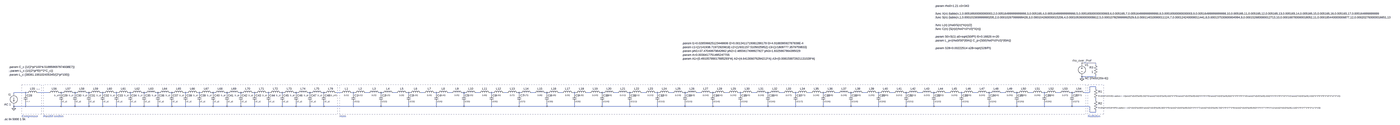
[diagram p0: schematic AC_Overall.asc, whole sheet]
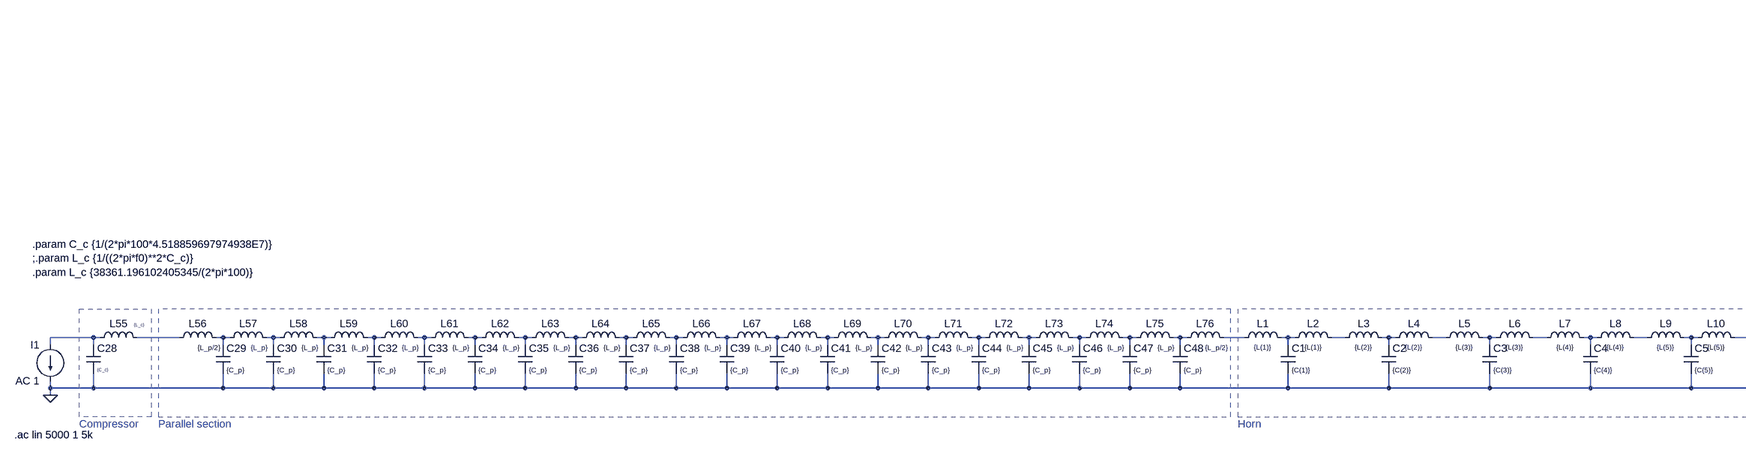
[diagram p1: schematic AC_Overall.asc, part, row 1 of 1, column 1 of 3]
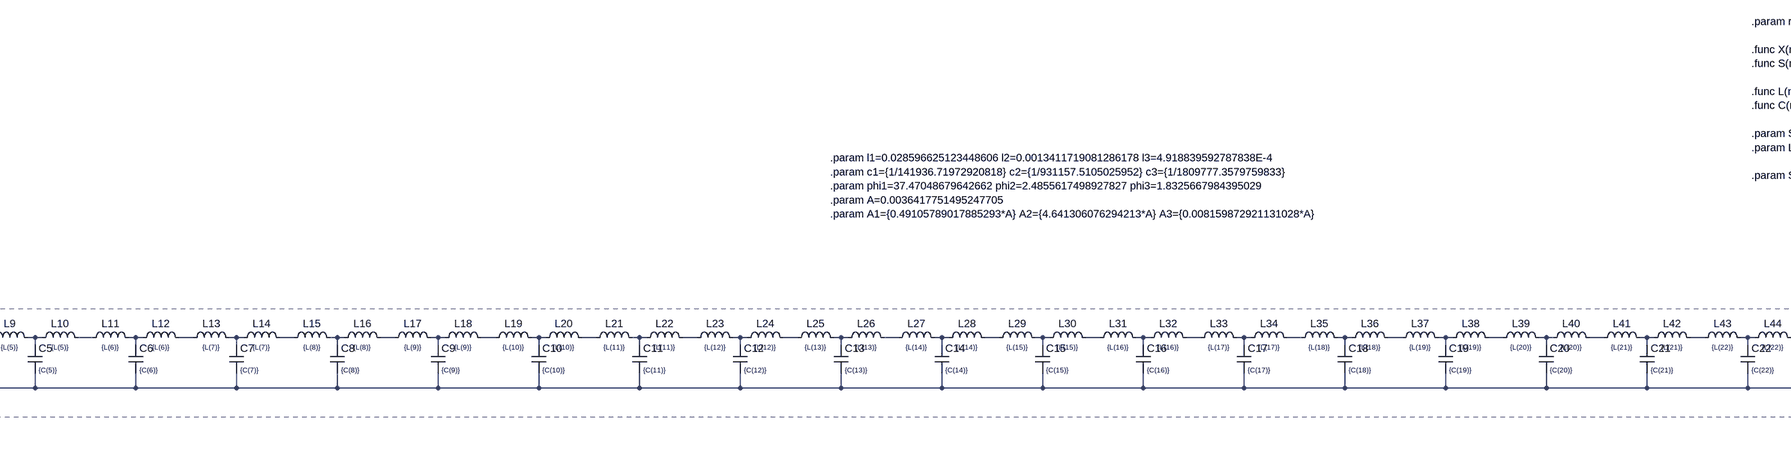
[diagram p2: schematic AC_Overall.asc, part, row 1 of 1, column 2 of 3]
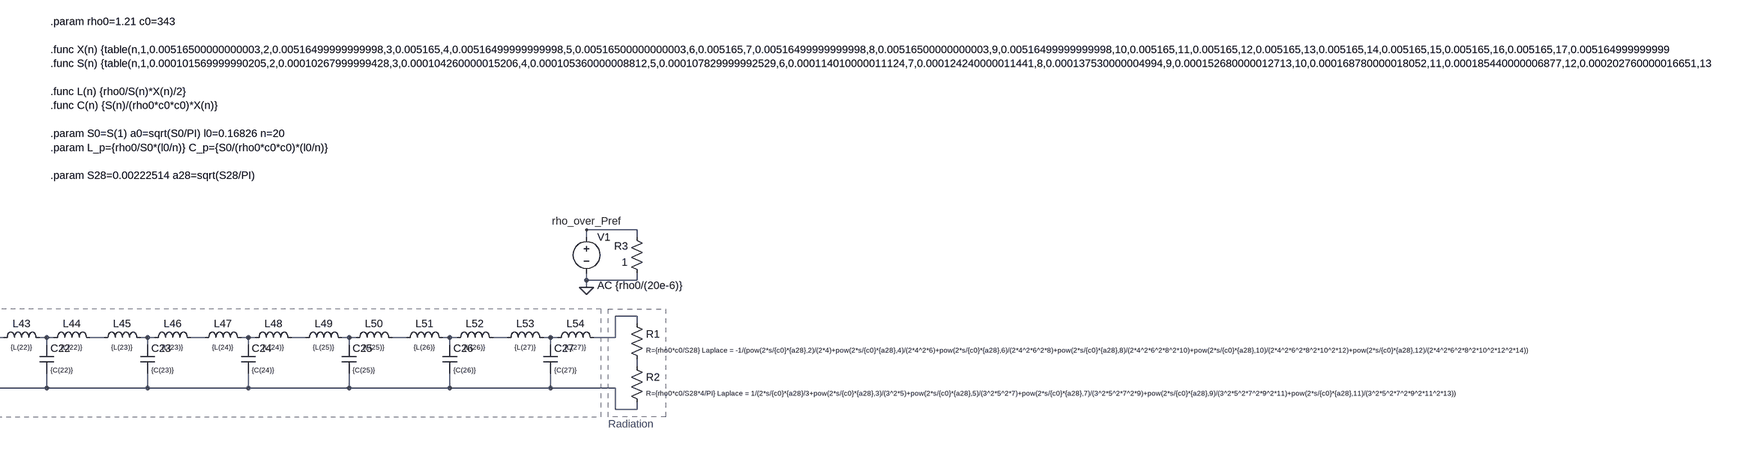
[diagram p3: schematic AC_Overall.asc, part, row 1 of 1, column 3 of 3]
AC_Overall.asc, the LTspice schematic file:
Version 4
SHEET 1 12020 680
WIRE 4432 -128 4320 -128
WIRE 4320 -112 4320 -128
WIRE 4432 -112 4432 -128
WIRE 4320 -16 4320 -32
WIRE 4432 -16 4432 -32
WIRE 4432 -16 4320 -16
WIRE 4320 0 4320 -16
WIRE 4432 64 4384 64
WIRE 4432 80 4432 64
WIRE -4240 112 -4336 112
WIRE -4224 112 -4240 112
WIRE -4048 112 -4144 112
WIRE -3952 112 -3968 112
WIRE -3936 112 -3952 112
WIRE -3840 112 -3856 112
WIRE -3824 112 -3840 112
WIRE -3728 112 -3744 112
WIRE -3712 112 -3728 112
WIRE -3616 112 -3632 112
WIRE -3600 112 -3616 112
WIRE -3504 112 -3520 112
WIRE -3488 112 -3504 112
WIRE -3392 112 -3408 112
WIRE -3376 112 -3392 112
WIRE -3280 112 -3296 112
WIRE -3264 112 -3280 112
WIRE -3168 112 -3184 112
WIRE -3152 112 -3168 112
WIRE -3056 112 -3072 112
WIRE -3040 112 -3056 112
WIRE -2944 112 -2960 112
WIRE -2928 112 -2944 112
WIRE -2832 112 -2848 112
WIRE -2816 112 -2832 112
WIRE -2720 112 -2736 112
WIRE -2704 112 -2720 112
WIRE -2608 112 -2624 112
WIRE -2592 112 -2608 112
WIRE -2496 112 -2512 112
WIRE -2480 112 -2496 112
WIRE -2384 112 -2400 112
WIRE -2368 112 -2384 112
WIRE -2272 112 -2288 112
WIRE -2256 112 -2272 112
WIRE -2160 112 -2176 112
WIRE -2144 112 -2160 112
WIRE -2048 112 -2064 112
WIRE -2032 112 -2048 112
WIRE -1936 112 -1952 112
WIRE -1920 112 -1936 112
WIRE -1824 112 -1840 112
WIRE -1808 112 -1824 112
WIRE -1680 112 -1728 112
WIRE -1584 112 -1600 112
WIRE -1568 112 -1584 112
WIRE -1456 112 -1488 112
WIRE -1360 112 -1376 112
WIRE -1344 112 -1360 112
WIRE -1232 112 -1264 112
WIRE -1136 112 -1152 112
WIRE -1120 112 -1136 112
WIRE -1008 112 -1040 112
WIRE -912 112 -928 112
WIRE -896 112 -912 112
WIRE -784 112 -816 112
WIRE -688 112 -704 112
WIRE -672 112 -688 112
WIRE -560 112 -592 112
WIRE -464 112 -480 112
WIRE -448 112 -464 112
WIRE -336 112 -368 112
WIRE -240 112 -256 112
WIRE -224 112 -240 112
WIRE -112 112 -144 112
WIRE -16 112 -32 112
WIRE 0 112 -16 112
WIRE 112 112 80 112
WIRE 208 112 192 112
WIRE 224 112 208 112
WIRE 336 112 304 112
WIRE 432 112 416 112
WIRE 448 112 432 112
WIRE 560 112 528 112
WIRE 656 112 640 112
WIRE 672 112 656 112
WIRE 784 112 752 112
WIRE 880 112 864 112
WIRE 896 112 880 112
WIRE 1008 112 976 112
WIRE 1104 112 1088 112
WIRE 1120 112 1104 112
WIRE 1232 112 1200 112
WIRE 1328 112 1312 112
WIRE 1344 112 1328 112
WIRE 1456 112 1424 112
WIRE 1552 112 1536 112
WIRE 1568 112 1552 112
WIRE 1680 112 1648 112
WIRE 1776 112 1760 112
WIRE 1792 112 1776 112
WIRE 1904 112 1872 112
WIRE 2000 112 1984 112
WIRE 2016 112 2000 112
WIRE 2128 112 2096 112
WIRE 2224 112 2208 112
WIRE 2240 112 2224 112
WIRE 2352 112 2320 112
WIRE 2448 112 2432 112
WIRE 2464 112 2448 112
WIRE 2576 112 2544 112
WIRE 2672 112 2656 112
WIRE 2688 112 2672 112
WIRE 2800 112 2768 112
WIRE 2896 112 2880 112
WIRE 2912 112 2896 112
WIRE 3024 112 2992 112
WIRE 3120 112 3104 112
WIRE 3136 112 3120 112
WIRE 3248 112 3216 112
WIRE 3344 112 3328 112
WIRE 3360 112 3344 112
WIRE 3472 112 3440 112
WIRE 3568 112 3552 112
WIRE 3584 112 3568 112
WIRE 3696 112 3664 112
WIRE 3792 112 3776 112
WIRE 3808 112 3792 112
WIRE 3920 112 3888 112
WIRE 4016 112 4000 112
WIRE 4032 112 4016 112
WIRE 4144 112 4112 112
WIRE 4240 112 4224 112
WIRE 4256 112 4240 112
WIRE 4384 112 4384 64
WIRE 4384 112 4336 112
WIRE -4336 128 -4336 112
WIRE -4240 128 -4240 112
WIRE -3952 128 -3952 112
WIRE -3840 128 -3840 112
WIRE -3728 128 -3728 112
WIRE -3616 128 -3616 112
WIRE -3504 128 -3504 112
WIRE -3392 128 -3392 112
WIRE -3280 128 -3280 112
WIRE -3168 128 -3168 112
WIRE -3056 128 -3056 112
WIRE -2944 128 -2944 112
WIRE -2832 128 -2832 112
WIRE -2720 128 -2720 112
WIRE -2608 128 -2608 112
WIRE -2496 128 -2496 112
WIRE -2384 128 -2384 112
WIRE -2272 128 -2272 112
WIRE -2160 128 -2160 112
WIRE -2048 128 -2048 112
WIRE -1936 128 -1936 112
WIRE -1824 128 -1824 112
WIRE -1584 128 -1584 112
WIRE -1360 128 -1360 112
WIRE -1136 128 -1136 112
WIRE -912 128 -912 112
WIRE -688 128 -688 112
WIRE -464 128 -464 112
WIRE -240 128 -240 112
WIRE -16 128 -16 112
WIRE 208 128 208 112
WIRE 432 128 432 112
WIRE 656 128 656 112
WIRE 880 128 880 112
WIRE 1104 128 1104 112
WIRE 1328 128 1328 112
WIRE 1552 128 1552 112
WIRE 1776 128 1776 112
WIRE 2000 128 2000 112
WIRE 2224 128 2224 112
WIRE 2448 128 2448 112
WIRE 2672 128 2672 112
WIRE 2896 128 2896 112
WIRE 3120 128 3120 112
WIRE 3344 128 3344 112
WIRE 3568 128 3568 112
WIRE 3792 128 3792 112
WIRE 4016 128 4016 112
WIRE 4240 128 4240 112
WIRE 4432 176 4432 160
WIRE -4336 224 -4336 208
WIRE -4240 224 -4240 192
WIRE -4240 224 -4336 224
WIRE -3952 224 -3952 192
WIRE -3952 224 -4240 224
WIRE -3840 224 -3840 192
WIRE -3840 224 -3952 224
WIRE -3728 224 -3728 192
WIRE -3728 224 -3840 224
WIRE -3616 224 -3616 192
WIRE -3616 224 -3728 224
WIRE -3504 224 -3504 192
WIRE -3504 224 -3616 224
WIRE -3392 224 -3392 192
WIRE -3392 224 -3504 224
WIRE -3280 224 -3280 192
WIRE -3280 224 -3392 224
WIRE -3168 224 -3168 192
WIRE -3168 224 -3280 224
WIRE -3056 224 -3056 192
WIRE -3056 224 -3168 224
WIRE -2944 224 -2944 192
WIRE -2944 224 -3056 224
WIRE -2832 224 -2832 192
WIRE -2832 224 -2944 224
WIRE -2720 224 -2720 192
WIRE -2720 224 -2832 224
WIRE -2608 224 -2608 192
WIRE -2608 224 -2720 224
WIRE -2496 224 -2496 192
WIRE -2496 224 -2608 224
WIRE -2384 224 -2384 192
WIRE -2384 224 -2496 224
WIRE -2272 224 -2272 192
WIRE -2272 224 -2384 224
WIRE -2160 224 -2160 192
WIRE -2160 224 -2272 224
WIRE -2048 224 -2048 192
WIRE -2048 224 -2160 224
WIRE -1936 224 -1936 192
WIRE -1936 224 -2048 224
WIRE -1824 224 -1824 192
WIRE -1824 224 -1936 224
WIRE -1584 224 -1584 192
WIRE -1584 224 -1824 224
WIRE -1360 224 -1360 192
WIRE -1360 224 -1584 224
WIRE -1136 224 -1136 192
WIRE -1136 224 -1360 224
WIRE -912 224 -912 192
WIRE -912 224 -1136 224
WIRE -688 224 -688 192
WIRE -688 224 -912 224
WIRE -464 224 -464 192
WIRE -464 224 -688 224
WIRE -240 224 -240 192
WIRE -240 224 -464 224
WIRE -16 224 -16 192
WIRE -16 224 -240 224
WIRE 208 224 208 192
WIRE 208 224 -16 224
WIRE 432 224 432 192
WIRE 432 224 208 224
WIRE 656 224 656 192
WIRE 656 224 432 224
WIRE 880 224 880 192
WIRE 880 224 656 224
WIRE 1104 224 1104 192
WIRE 1104 224 880 224
WIRE 1328 224 1328 192
WIRE 1328 224 1104 224
WIRE 1552 224 1552 192
WIRE 1552 224 1328 224
WIRE 1776 224 1776 192
WIRE 1776 224 1552 224
WIRE 2000 224 2000 192
WIRE 2000 224 1776 224
WIRE 2224 224 2224 192
WIRE 2224 224 2000 224
WIRE 2448 224 2448 192
WIRE 2448 224 2224 224
WIRE 2672 224 2672 192
WIRE 2672 224 2448 224
WIRE 2896 224 2896 192
WIRE 2896 224 2672 224
WIRE 3120 224 3120 192
WIRE 3120 224 2896 224
WIRE 3344 224 3344 192
WIRE 3344 224 3120 224
WIRE 3568 224 3568 192
WIRE 3568 224 3344 224
WIRE 3792 224 3792 192
WIRE 3792 224 3568 224
WIRE 4016 224 4016 192
WIRE 4016 224 3792 224
WIRE 4240 224 4240 192
WIRE 4240 224 4016 224
WIRE 4384 224 4240 224
WIRE -4336 240 -4336 224
WIRE 4384 272 4384 224
WIRE 4432 272 4432 256
WIRE 4432 272 4384 272
FLAG -4336 240 0
FLAG 4320 0 0
FLAG 4320 -128 rho_over_Pref
SYMBOL ind -1696 128 R270
WINDOW 0 32 56 VTop 2
WINDOW 3 5 56 VBottom 1
SYMATTR InstName L1
SYMATTR Value {L(1)}
SYMBOL ind -1584 128 R270
WINDOW 0 32 56 VTop 2
WINDOW 3 5 56 VBottom 1
SYMATTR InstName L2
SYMATTR Value {L(1)}
SYMBOL cap -1600 128 R0
WINDOW 3 24 56 Left 1
SYMATTR Value {C(1)}
SYMATTR InstName C1
SYMBOL ind -1472 128 R270
WINDOW 0 32 56 VTop 2
WINDOW 3 5 56 VBottom 1
SYMATTR InstName L3
SYMATTR Value {L(2)}
SYMBOL ind -1360 128 R270
WINDOW 0 32 56 VTop 2
WINDOW 3 5 56 VBottom 1
SYMATTR InstName L4
SYMATTR Value {L(2)}
SYMBOL cap -1376 128 R0
WINDOW 3 24 56 Left 1
SYMATTR Value {C(2)}
SYMATTR InstName C2
SYMBOL ind -1248 128 R270
WINDOW 0 32 56 VTop 2
WINDOW 3 5 56 VBottom 1
SYMATTR InstName L5
SYMATTR Value {L(3)}
SYMBOL ind -1136 128 R270
WINDOW 0 32 56 VTop 2
WINDOW 3 5 56 VBottom 1
SYMATTR InstName L6
SYMATTR Value {L(3)}
SYMBOL cap -1152 128 R0
WINDOW 3 24 56 Left 1
SYMATTR Value {C(3)}
SYMATTR InstName C3
SYMBOL ind -1024 128 R270
WINDOW 0 32 56 VTop 2
WINDOW 3 5 56 VBottom 1
SYMATTR InstName L7
SYMATTR Value {L(4)}
SYMBOL ind -912 128 R270
WINDOW 0 32 56 VTop 2
WINDOW 3 5 56 VBottom 1
SYMATTR InstName L8
SYMATTR Value {L(4)}
SYMBOL cap -928 128 R0
WINDOW 3 24 56 Left 1
SYMATTR Value {C(4)}
SYMATTR InstName C4
SYMBOL ind -800 128 R270
WINDOW 0 32 56 VTop 2
WINDOW 3 5 56 VBottom 1
SYMATTR InstName L9
SYMATTR Value {L(5)}
SYMBOL ind -688 128 R270
WINDOW 0 32 56 VTop 2
WINDOW 3 5 56 VBottom 1
SYMATTR InstName L10
SYMATTR Value {L(5)}
SYMBOL cap -704 128 R0
WINDOW 3 24 56 Left 1
SYMATTR Value {C(5)}
SYMATTR InstName C5
SYMBOL ind -576 128 R270
WINDOW 0 32 56 VTop 2
WINDOW 3 5 56 VBottom 1
SYMATTR InstName L11
SYMATTR Value {L(6)}
SYMBOL ind -464 128 R270
WINDOW 0 32 56 VTop 2
WINDOW 3 5 56 VBottom 1
SYMATTR InstName L12
SYMATTR Value {L(6)}
SYMBOL cap -480 128 R0
WINDOW 3 24 56 Left 1
SYMATTR Value {C(6)}
SYMATTR InstName C6
SYMBOL ind -352 128 R270
WINDOW 0 32 56 VTop 2
WINDOW 3 5 56 VBottom 1
SYMATTR InstName L13
SYMATTR Value {L(7)}
SYMBOL ind -240 128 R270
WINDOW 0 32 56 VTop 2
WINDOW 3 5 56 VBottom 1
SYMATTR InstName L14
SYMATTR Value {L(7)}
SYMBOL cap -256 128 R0
WINDOW 3 24 56 Left 1
SYMATTR Value {C(7)}
SYMATTR InstName C7
SYMBOL ind -128 128 R270
WINDOW 0 32 56 VTop 2
WINDOW 3 5 56 VBottom 1
SYMATTR InstName L15
SYMATTR Value {L(8)}
SYMBOL ind -16 128 R270
WINDOW 0 32 56 VTop 2
WINDOW 3 5 56 VBottom 1
SYMATTR InstName L16
SYMATTR Value {L(8)}
SYMBOL cap -32 128 R0
WINDOW 3 24 56 Left 1
SYMATTR Value {C(8)}
SYMATTR InstName C8
SYMBOL ind 96 128 R270
WINDOW 0 32 56 VTop 2
WINDOW 3 5 56 VBottom 1
SYMATTR InstName L17
SYMATTR Value {L(9)}
SYMBOL ind 208 128 R270
WINDOW 0 32 56 VTop 2
WINDOW 3 5 56 VBottom 1
SYMATTR InstName L18
SYMATTR Value {L(9)}
SYMBOL cap 192 128 R0
WINDOW 3 24 56 Left 1
SYMATTR Value {C(9)}
SYMATTR InstName C9
SYMBOL ind 320 128 R270
WINDOW 0 32 56 VTop 2
WINDOW 3 5 56 VBottom 1
SYMATTR InstName L19
SYMATTR Value {L(10)}
SYMBOL ind 432 128 R270
WINDOW 0 32 56 VTop 2
WINDOW 3 5 56 VBottom 1
SYMATTR InstName L20
SYMATTR Value {L(10)}
SYMBOL cap 416 128 R0
WINDOW 3 24 56 Left 1
SYMATTR Value {C(10)}
SYMATTR InstName C10
SYMBOL ind 544 128 R270
WINDOW 0 32 56 VTop 2
WINDOW 3 5 56 VBottom 1
SYMATTR InstName L21
SYMATTR Value {L(11)}
SYMBOL ind 656 128 R270
WINDOW 0 32 56 VTop 2
WINDOW 3 5 56 VBottom 1
SYMATTR InstName L22
SYMATTR Value {L(11)}
SYMBOL cap 640 128 R0
WINDOW 3 24 56 Left 1
SYMATTR Value {C(11)}
SYMATTR InstName C11
SYMBOL ind 768 128 R270
WINDOW 0 32 56 VTop 2
WINDOW 3 5 56 VBottom 1
SYMATTR InstName L23
SYMATTR Value {L(12)}
SYMBOL ind 880 128 R270
WINDOW 0 32 56 VTop 2
WINDOW 3 5 56 VBottom 1
SYMATTR InstName L24
SYMATTR Value {L(12)}
SYMBOL cap 864 128 R0
WINDOW 3 24 56 Left 1
SYMATTR Value {C(12)}
SYMATTR InstName C12
SYMBOL ind 992 128 R270
WINDOW 0 32 56 VTop 2
WINDOW 3 5 56 VBottom 1
SYMATTR InstName L25
SYMATTR Value {L(13)}
SYMBOL ind 1104 128 R270
WINDOW 0 32 56 VTop 2
WINDOW 3 5 56 VBottom 1
SYMATTR InstName L26
SYMATTR Value {L(13)}
SYMBOL cap 1088 128 R0
WINDOW 3 24 56 Left 1
SYMATTR Value {C(13)}
SYMATTR InstName C13
SYMBOL ind 1216 128 R270
WINDOW 0 32 56 VTop 2
WINDOW 3 5 56 VBottom 1
SYMATTR InstName L27
SYMATTR Value {L(14)}
SYMBOL ind 1328 128 R270
WINDOW 0 32 56 VTop 2
WINDOW 3 5 56 VBottom 1
SYMATTR InstName L28
SYMATTR Value {L(14)}
SYMBOL cap 1312 128 R0
WINDOW 3 24 56 Left 1
SYMATTR Value {C(14)}
SYMATTR InstName C14
SYMBOL ind 1440 128 R270
WINDOW 0 32 56 VTop 2
WINDOW 3 5 56 VBottom 1
SYMATTR InstName L29
SYMATTR Value {L(15)}
SYMBOL ind 1552 128 R270
WINDOW 0 32 56 VTop 2
WINDOW 3 5 56 VBottom 1
SYMATTR InstName L30
SYMATTR Value {L(15)}
SYMBOL cap 1536 128 R0
WINDOW 3 24 56 Left 1
SYMATTR Value {C(15)}
SYMATTR InstName C15
SYMBOL ind 1664 128 R270
WINDOW 0 32 56 VTop 2
WINDOW 3 5 56 VBottom 1
SYMATTR InstName L31
SYMATTR Value {L(16)}
SYMBOL ind 1776 128 R270
WINDOW 0 32 56 VTop 2
WINDOW 3 5 56 VBottom 1
SYMATTR InstName L32
SYMATTR Value {L(16)}
SYMBOL cap 1760 128 R0
WINDOW 3 24 56 Left 1
SYMATTR Value {C(16)}
SYMATTR InstName C16
SYMBOL ind 1888 128 R270
WINDOW 0 32 56 VTop 2
WINDOW 3 5 56 VBottom 1
SYMATTR InstName L33
SYMATTR Value {L(17)}
SYMBOL ind 2000 128 R270
WINDOW 0 32 56 VTop 2
WINDOW 3 5 56 VBottom 1
SYMATTR InstName L34
SYMATTR Value {L(17)}
SYMBOL cap 1984 128 R0
WINDOW 3 24 56 Left 1
SYMATTR Value {C(17)}
SYMATTR InstName C17
SYMBOL ind 2112 128 R270
WINDOW 0 32 56 VTop 2
WINDOW 3 5 56 VBottom 1
SYMATTR InstName L35
SYMATTR Value {L(18)}
SYMBOL ind 2224 128 R270
WINDOW 0 32 56 VTop 2
WINDOW 3 5 56 VBottom 1
SYMATTR InstName L36
SYMATTR Value {L(18)}
SYMBOL cap 2208 128 R0
WINDOW 3 24 56 Left 1
SYMATTR Value {C(18)}
SYMATTR InstName C18
SYMBOL ind 2336 128 R270
WINDOW 0 32 56 VTop 2
WINDOW 3 5 56 VBottom 1
SYMATTR InstName L37
SYMATTR Value {L(19)}
SYMBOL ind 2448 128 R270
WINDOW 0 32 56 VTop 2
WINDOW 3 5 56 VBottom 1
SYMATTR InstName L38
SYMATTR Value {L(19)}
SYMBOL cap 2432 128 R0
WINDOW 3 24 56 Left 1
SYMATTR Value {C(19)}
SYMATTR InstName C19
SYMBOL ind 2560 128 R270
WINDOW 0 32 56 VTop 2
WINDOW 3 5 56 VBottom 1
SYMATTR InstName L39
SYMATTR Value {L(20)}
SYMBOL ind 2672 128 R270
WINDOW 0 32 56 VTop 2
WINDOW 3 5 56 VBottom 1
SYMATTR InstName L40
SYMATTR Value {L(20)}
SYMBOL cap 2656 128 R0
WINDOW 3 24 56 Left 1
SYMATTR Value {C(20)}
SYMATTR InstName C20
SYMBOL ind 2784 128 R270
WINDOW 0 32 56 VTop 2
WINDOW 3 5 56 VBottom 1
SYMATTR InstName L41
SYMATTR Value {L(21)}
SYMBOL ind 2896 128 R270
WINDOW 0 32 56 VTop 2
WINDOW 3 5 56 VBottom 1
SYMATTR InstName L42
SYMATTR Value {L(21)}
SYMBOL cap 2880 128 R0
WINDOW 3 24 56 Left 1
SYMATTR Value {C(21)}
SYMATTR InstName C21
SYMBOL ind 3008 128 R270
WINDOW 0 32 56 VTop 2
WINDOW 3 5 56 VBottom 1
SYMATTR InstName L43
SYMATTR Value {L(22)}
SYMBOL ind 3120 128 R270
WINDOW 0 32 56 VTop 2
WINDOW 3 5 56 VBottom 1
SYMATTR InstName L44
SYMATTR Value {L(22)}
SYMBOL cap 3104 128 R0
WINDOW 3 24 56 Left 1
SYMATTR Value {C(22)}
SYMATTR InstName C22
SYMBOL ind 3232 128 R270
WINDOW 0 32 56 VTop 2
WINDOW 3 5 56 VBottom 1
SYMATTR InstName L45
SYMATTR Value {L(23)}
SYMBOL ind 3344 128 R270
WINDOW 0 32 56 VTop 2
WINDOW 3 5 56 VBottom 1
SYMATTR InstName L46
SYMATTR Value {L(23)}
SYMBOL cap 3328 128 R0
WINDOW 3 24 56 Left 1
SYMATTR Value {C(23)}
SYMATTR InstName C23
SYMBOL ind 3456 128 R270
WINDOW 0 32 56 VTop 2
WINDOW 3 5 56 VBottom 1
SYMATTR InstName L47
SYMATTR Value {L(24)}
SYMBOL ind 3568 128 R270
WINDOW 0 32 56 VTop 2
WINDOW 3 5 56 VBottom 1
SYMATTR InstName L48
SYMATTR Value {L(24)}
SYMBOL cap 3552 128 R0
WINDOW 3 24 56 Left 1
SYMATTR Value {C(24)}
SYMATTR InstName C24
SYMBOL ind 3680 128 R270
WINDOW 0 32 56 VTop 2
WINDOW 3 5 56 VBottom 1
SYMATTR InstName L49
SYMATTR Value {L(25)}
SYMBOL ind 3792 128 R270
WINDOW 0 32 56 VTop 2
WINDOW 3 5 56 VBottom 1
SYMATTR InstName L50
SYMATTR Value {L(25)}
SYMBOL cap 3776 128 R0
WINDOW 3 24 56 Left 1
SYMATTR Value {C(25)}
SYMATTR InstName C25
SYMBOL ind 3904 128 R270
WINDOW 0 32 56 VTop 2
WINDOW 3 5 56 VBottom 1
SYMATTR InstName L51
SYMATTR Value {L(26)}
SYMBOL ind 4016 128 R270
WINDOW 0 32 56 VTop 2
WINDOW 3 5 56 VBottom 1
SYMATTR InstName L52
SYMATTR Value {L(26)}
SYMBOL cap 4000 128 R0
WINDOW 3 24 56 Left 1
SYMATTR Value {C(26)}
SYMATTR InstName C26
SYMBOL ind 4128 128 R270
WINDOW 0 32 56 VTop 2
WINDOW 3 5 56 VBottom 1
SYMATTR InstName L53
SYMATTR Value {L(27)}
SYMBOL ind 4240 128 R270
WINDOW 0 32 56 VTop 2
WINDOW 3 5 56 VBottom 1
SYMATTR InstName L54
SYMATTR Value {L(27)}
SYMBOL cap 4224 128 R0
WINDOW 3 24 56 Left 1
SYMATTR Value {C(27)}
SYMATTR InstName C27
SYMBOL res 4416 64 R0
WINDOW 3 36 76 Left 1
SYMATTR Value R={rho0*c0/S28} Laplace = -1/(pow(2*s/{c0}*{a28},2)/(2*4)+pow(2*s/{c0}*{a28},4)/(2*4^2*6)+pow(2*s/{c0}*{a28},6)/(2*4^2*6^2*8)+pow(2*s/{c0}*{a28},8)/(2*4^2*6^2*8^2*10)+pow(2*s/{c0}*{a28},10)/(2*4^2*6^2*8^2*10^2*12)+pow(2*s/{c0}*{a28},12)/(2*4^2*6^2*8^2*10^2*12^2*14))
SYMATTR InstName R1
SYMBOL res 4416 160 R0
WINDOW 3 36 76 Left 1
SYMATTR Value R={rho0*c0/S28*4/PI} Laplace = 1/(2*s/{c0}*{a28}/3+pow(2*s/{c0}*{a28},3)/(3^2*5)+pow(2*s/{c0}*{a28},5)/(3^2*5^2*7)+pow(2*s/{c0}*{a28},7)/(3^2*5^2*7^2*9)+pow(2*s/{c0}*{a28},9)/(3^2*5^2*7^2*9^2*11)+pow(2*s/{c0}*{a28},11)/(3^2*5^2*7^2*9^2*11^2*13))
SYMATTR InstName R2
SYMBOL ind -4240 128 R270
WINDOW 0 32 56 VTop 2
WINDOW 3 44 90 VRight 0
SYMATTR InstName L55
SYMATTR Value {L_c}
SYMBOL cap -4256 128 R0
WINDOW 3 24 56 Left 0
SYMATTR Value {C_c}
SYMATTR InstName C28
SYMBOL ind -4064 128 R270
WINDOW 0 32 56 VTop 2
WINDOW 3 4 81 VBottom 1
SYMATTR InstName L56
SYMATTR Value {L_p/2}
SYMBOL cap -3968 128 R0
WINDOW 3 24 56 Left 1
SYMATTR Value {C_p}
SYMATTR InstName C29
SYMBOL ind -3952 128 R270
WINDOW 0 32 56 VTop 2
WINDOW 3 4 81 VBottom 1
SYMATTR InstName L57
SYMATTR Value {L_p}
SYMBOL cap -3856 128 R0
WINDOW 3 24 56 Left 1
SYMATTR Value {C_p}
SYMATTR InstName C30
SYMBOL ind -3840 128 R270
WINDOW 0 32 56 VTop 2
WINDOW 3 4 81 VBottom 1
SYMATTR InstName L58
SYMATTR Value {L_p}
SYMBOL cap -3744 128 R0
WINDOW 3 24 56 Left 1
SYMATTR Value {C_p}
SYMATTR InstName C31
SYMBOL ind -3728 128 R270
WINDOW 0 32 56 VTop 2
WINDOW 3 4 81 VBottom 1
SYMATTR InstName L59
SYMATTR Value {L_p}
SYMBOL cap -3632 128 R0
WINDOW 3 24 56 Left 1
SYMATTR Value {C_p}
SYMATTR InstName C32
SYMBOL ind -3616 128 R270
WINDOW 0 32 56 VTop 2
WINDOW 3 4 81 VBottom 1
SYMATTR InstName L60
SYMATTR Value {L_p}
SYMBOL cap -3520 128 R0
WINDOW 3 24 56 Left 1
SYMATTR Value {C_p}
SYMATTR InstName C33
SYMBOL ind -3504 128 R270
WINDOW 0 32 56 VTop 2
WINDOW 3 4 81 VBottom 1
SYMATTR InstName L61
SYMATTR Value {L_p}
SYMBOL cap -3408 128 R0
WINDOW 3 24 56 Left 1
SYMATTR Value {C_p}
SYMATTR InstName C34
SYMBOL ind -3392 128 R270
WINDOW 0 32 56 VTop 2
WINDOW 3 4 81 VBottom 1
SYMATTR InstName L62
SYMATTR Value {L_p}
SYMBOL cap -3296 128 R0
WINDOW 3 24 56 Left 1
SYMATTR Value {C_p}
SYMATTR InstName C35
SYMBOL ind -3280 128 R270
WINDOW 0 32 56 VTop 2
WINDOW 3 4 81 VBottom 1
SYMATTR InstName L63
SYMATTR Value {L_p}
SYMBOL cap -3184 128 R0
WINDOW 3 24 56 Left 1
SYMATTR Value {C_p}
SYMATTR InstName C36
SYMBOL ind -3168 128 R270
WINDOW 0 32 56 VTop 2
WINDOW 3 4 81 VBottom 1
SYMATTR InstName L64
SYMATTR Value {L_p}
SYMBOL cap -3072 128 R0
WINDOW 3 24 56 Left 1
SYMATTR Value {C_p}
SYMATTR InstName C37
SYMBOL ind -3056 128 R270
WINDOW 0 32 56 VTop 2
WINDOW 3 4 81 VBottom 1
SYMATTR InstName L65
SYMATTR Value {L_p}
SYMBOL cap -2960 128 R0
WINDOW 3 24 56 Left 1
SYMATTR Value {C_p}
SYMATTR InstName C38
SYMBOL ind -2944 128 R270
WINDOW 0 32 56 VTop 2
WINDOW 3 4 81 VBottom 1
SYMATTR InstName L66
SYMATTR Value {L_p}
SYMBOL cap -2848 128 R0
WINDOW 3 24 56 Left 1
SYMATTR Value {C_p}
SYMATTR InstName C39
SYMBOL ind -2832 128 R270
WINDOW 0 32 56 VTop 2
WINDOW 3 4 81 VBottom 1
SYMATTR InstName L67
SYMATTR Value {L_p}
SYMBOL cap -2736 128 R0
WINDOW 3 24 56 Left 1
SYMATTR Value {C_p}
SYMATTR InstName C40
SYMBOL ind -2720 128 R270
WINDOW 0 32 56 VTop 2
WINDOW 3 4 81 VBottom 1
SYMATTR InstName L68
SYMATTR Value {L_p}
SYMBOL cap -2624 128 R0
WINDOW 3 24 56 Left 1
SYMATTR Value {C_p}
SYMATTR InstName C41
SYMBOL ind -2608 128 R270
WINDOW 0 32 56 VTop 2
WINDOW 3 4 81 VBottom 1
SYMATTR InstName L69
SYMATTR Value {L_p}
SYMBOL cap -2512 128 R0
WINDOW 3 24 56 Left 1
SYMATTR Value {C_p}
SYMATTR InstName C42
SYMBOL ind -2496 128 R270
WINDOW 0 32 56 VTop 2
WINDOW 3 4 81 VBottom 1
SYMATTR InstName L70
SYMATTR Value {L_p}
SYMBOL cap -2400 128 R0
WINDOW 3 24 56 Left 1
SYMATTR Value {C_p}
SYMATTR InstName C43
SYMBOL ind -2384 128 R270
WINDOW 0 32 56 VTop 2
WINDOW 3 4 81 VBottom 1
SYMATTR InstName L71
SYMATTR Value {L_p}
SYMBOL cap -2288 128 R0
WINDOW 3 24 56 Left 1
SYMATTR Value {C_p}
SYMATTR InstName C44
SYMBOL ind -2272 128 R270
WINDOW 0 32 56 VTop 2
WINDOW 3 4 81 VBottom 1
SYMATTR InstName L72
SYMATTR Value {L_p}
SYMBOL cap -2176 128 R0
WINDOW 3 24 56 Left 1
SYMATTR Value {C_p}
SYMATTR InstName C45
SYMBOL ind -2160 128 R270
WINDOW 0 32 56 VTop 2
WINDOW 3 4 81 VBottom 1
SYMATTR InstName L73
SYMATTR Value {L_p}
SYMBOL cap -2064 128 R0
WINDOW 3 24 56 Left 1
SYMATTR Value {C_p}
SYMATTR InstName C46
SYMBOL ind -2048 128 R270
WINDOW 0 32 56 VTop 2
WINDOW 3 4 81 VBottom 1
SYMATTR InstName L74
SYMATTR Value {L_p}
SYMBOL cap -1952 128 R0
WINDOW 3 24 56 Left 1
SYMATTR Value {C_p}
SYMATTR InstName C47
SYMBOL ind -1936 128 R270
WINDOW 0 32 56 VTop 2
WINDOW 3 4 81 VBottom 1
SYMATTR InstName L75
SYMATTR Value {L_p}
SYMBOL cap -1840 128 R0
WINDOW 3 24 56 Left 1
SYMATTR Value {C_p}
SYMATTR InstName C48
SYMBOL ind -1824 128 R270
WINDOW 0 32 56 VTop 2
WINDOW 3 4 81 VBottom 1
SYMATTR InstName L76
SYMATTR Value {L_p/2}
SYMBOL voltage 4320 -128 R0
WINDOW 123 24 124 Left 2
WINDOW 39 0 0 Left 0
SYMATTR Value2 AC {rho0/(20e-6)}
SYMATTR InstName V1
SYMATTR Value ""
SYMBOL res 4448 -16 R180
WINDOW 0 36 76 Left 2
WINDOW 3 36 40 Left 2
SYMATTR InstName R3
SYMATTR Value 1
SYMBOL current -4336 128 M0
WINDOW 123 0 0 Left 0
WINDOW 39 0 0 Left 0
SYMATTR InstName I1
SYMATTR Value AC 1
TEXT 4368 304 Left 2 ;Radiation
TEXT -1696 304 Left 2 ;Horn
TEXT -4096 304 Left 2 ;Parallel section
TEXT -4272 304 Left 2 ;Compressor
TEXT 3128 -592 Left 2 !.param rho0=1.21 c0=343\n \n.func X(n) {table(n,1,0.00516500000000003,2,0.00516499999999998,3,0.005165,4,0.00516499999999998,5,0.00516500000000003,6,0.005165,7,0.00516499999999998,8,0.00516500000000003,9,0.00516499999999998,10,0.005165,11,0.005165,12,0.005165,13,0.005165,14,0.005165,15,0.005165,16,0.005165,17,0.00516499999999998,18,0.00516500000000003,19,0.005,20,0.005,21,0.005,22,0.005,23,0.005,24,0.005,25,0.00499999999999995,26,0.005,27,0.005)}\n.func S(n) {table(n,1,0.000101569999990205,2,0.00010267999999428,3,0.000104260000015206,4,0.000105360000008812,5,0.000107829999992529,6,0.000114010000011124,7,0.000124240000011441,8,0.000137530000004994,9,0.000152680000012713,10,0.000168780000018052,11,0.000185440000006877,12,0.000202760000016651,13,0.000221379999987761,14,0.000242350000017738,15,0.000266620000003016,16,0.00029481999997399,17,0.000327350000158122,18,0.000363850000046359,19,0.000406440000084485,20,0.000427330000332941,21,0.000496469999910017,22,0.000592849999906204,23,0.000724820000043707,24,0.000911000000046875,25,0.00116684999984727,26,0.00147168000025428,27,0.0017486199997878)}\n \n.func L(n) {rho0/S(n)*X(n)/2}\n.func C(n) {S(n)/(rho0*c0*c0)*X(n)}\n \n.param S0=S(1) a0=sqrt(S0/PI) l0=0.16826 n=20 \n.param L_p={rho0/S0*(l0/n)} C_p={S0/(rho0*c0*c0)*(l0/n)}\n \n.param S28=0.00222514 a28=sqrt(S28/PI)
TEXT 1080 -288 Left 2 !.param l1=0.028596625123448606 l2=0.0013411719081286178 l3=4.918839592787838E-4\n.param c1={1/141936.71972920818} c2={1/931157.5105025952} c3={1/1809777.3579759833}\n.param phi1=37.47048679642662 phi2=2.4855617498927827 phi3=1.8325667984395029\n.param A=0.0036417751495247705\n.param A1={0.49105789017885293*A} A2={4.641306076294213*A} A3={0.008159872921131028*A}
TEXT -4416 328 Left 2 !.ac lin 5000 1 5k
TEXT -4376 -96 Left 2 !.param C_c {1/(2*pi*100*4.518859697974938E7)}\n;.param L_c {1/((2*pi*f0)**2*C_c)}\n.param L_c {38361.196102405345/(2*pi*100)}
RECTANGLE Normal 4496 288 4368 48 3
RECTANGLE Normal -1696 288 4352 48 3
RECTANGLE Normal -4112 288 -4272 48 3
RECTANGLE Normal -4096 288 -1712 48 3

The netlist it stands for:
* AC_Overall.asc
L1 N024 N025 {L(1)}
L2 N025 N026 {L(1)}
C1 N025 0 {C(1)}
L3 N026 N027 {L(2)}
L4 N027 N028 {L(2)}
C2 N027 0 {C(2)}
L5 N028 N029 {L(3)}
L6 N029 N030 {L(3)}
C3 N029 0 {C(3)}
L7 N030 N031 {L(4)}
L8 N031 N032 {L(4)}
C4 N031 0 {C(4)}
L9 N032 N033 {L(5)}
L10 N033 N034 {L(5)}
C5 N033 0 {C(5)}
L11 N034 N035 {L(6)}
L12 N035 N036 {L(6)}
C6 N035 0 {C(6)}
L13 N036 N037 {L(7)}
L14 N037 N038 {L(7)}
C7 N037 0 {C(7)}
L15 N038 N039 {L(8)}
L16 N039 N040 {L(8)}
C8 N039 0 {C(8)}
L17 N040 N041 {L(9)}
L18 N041 N042 {L(9)}
C9 N041 0 {C(9)}
L19 N042 N043 {L(10)}
L20 N043 N044 {L(10)}
C10 N043 0 {C(10)}
L21 N044 N045 {L(11)}
L22 N045 N046 {L(11)}
C11 N045 0 {C(11)}
L23 N046 N047 {L(12)}
L24 N047 N048 {L(12)}
C12 N047 0 {C(12)}
L25 N048 N049 {L(13)}
L26 N049 N050 {L(13)}
C13 N049 0 {C(13)}
L27 N050 N051 {L(14)}
L28 N051 N052 {L(14)}
C14 N051 0 {C(14)}
L29 N052 N053 {L(15)}
L30 N053 N054 {L(15)}
C15 N053 0 {C(15)}
L31 N054 N055 {L(16)}
L32 N055 N056 {L(16)}
C16 N055 0 {C(16)}
L33 N056 N057 {L(17)}
L34 N057 N058 {L(17)}
C17 N057 0 {C(17)}
L35 N058 N059 {L(18)}
L36 N059 N060 {L(18)}
C18 N059 0 {C(18)}
L37 N060 N061 {L(19)}
L38 N061 N062 {L(19)}
C19 N061 0 {C(19)}
L39 N062 N063 {L(20)}
L40 N063 N064 {L(20)}
C20 N063 0 {C(20)}
L41 N064 N065 {L(21)}
L42 N065 N066 {L(21)}
C21 N065 0 {C(21)}
L43 N066 N067 {L(22)}
L44 N067 N068 {L(22)}
C22 N067 0 {C(22)}
L45 N068 N069 {L(23)}
L46 N069 N070 {L(23)}
C23 N069 0 {C(23)}
L47 N070 N071 {L(24)}
L48 N071 N072 {L(24)}
C24 N071 0 {C(24)}
L49 N072 N073 {L(25)}
L50 N073 N074 {L(25)}
C25 N073 0 {C(25)}
L51 N074 N075 {L(26)}
L52 N075 N076 {L(26)}
C26 N075 0 {C(26)}
L53 N076 N077 {L(27)}
L54 N077 N001 {L(27)}
C27 N077 0 {C(27)}
R1 N001 N078 R={rho0*c0/S28} Laplace = -1/(pow(2*s/{c0}*{a28},2)/(2*4)+pow(2*s/{c0}*{a28},4)/(2*4^2*6)+pow(2*s/{c0}*{a28},6)/(2*4^2*6^2*8)+pow(2*s/{c0}*{a28},8)/(2*4^2*6^2*8^2*10)+pow(2*s/{c0}*{a28},10)/(2*4^2*6^2*8^2*10^2*12)+pow(2*s/{c0}*{a28},12)/(2*4^2*6^2*8^2*10^2*12^2*14))
R2 N078 0 R={rho0*c0/S28*4/PI} Laplace = 1/(2*s/{c0}*{a28}/3+pow(2*s/{c0}*{a28},3)/(3^2*5)+pow(2*s/{c0}*{a28},5)/(3^2*5^2*7)+pow(2*s/{c0}*{a28},7)/(3^2*5^2*7^2*9)+pow(2*s/{c0}*{a28},9)/(3^2*5^2*7^2*9^2*11)+pow(2*s/{c0}*{a28},11)/(3^2*5^2*7^2*9^2*11^2*13))
L55 N002 N003 {L_c}
C28 N002 0 {C_c}
L56 N003 N004 {L_p/2}
C29 N004 0 {C_p}
L57 N004 N005 {L_p}
C30 N005 0 {C_p}
L58 N005 N006 {L_p}
C31 N006 0 {C_p}
L59 N006 N007 {L_p}
C32 N007 0 {C_p}
L60 N007 N008 {L_p}
C33 N008 0 {C_p}
L61 N008 N009 {L_p}
C34 N009 0 {C_p}
L62 N009 N010 {L_p}
C35 N010 0 {C_p}
L63 N010 N011 {L_p}
C36 N011 0 {C_p}
L64 N011 N012 {L_p}
C37 N012 0 {C_p}
L65 N012 N013 {L_p}
C38 N013 0 {C_p}
L66 N013 N014 {L_p}
C39 N014 0 {C_p}
L67 N014 N015 {L_p}
C40 N015 0 {C_p}
L68 N015 N016 {L_p}
C41 N016 0 {C_p}
L69 N016 N017 {L_p}
C42 N017 0 {C_p}
L70 N017 N018 {L_p}
C43 N018 0 {C_p}
L71 N018 N019 {L_p}
C44 N019 0 {C_p}
L72 N019 N020 {L_p}
C45 N020 0 {C_p}
L73 N020 N021 {L_p}
C46 N021 0 {C_p}
L74 N021 N022 {L_p}
C47 N022 0 {C_p}
L75 N022 N023 {L_p}
C48 N023 0 {C_p}
L76 N023 N024 {L_p/2}
V1 rho_over_Pref 0 AC {rho0/(20e-6)}
R3 0 rho_over_Pref 1
I1 N002 0 AC 1
* Radiation
* Horn
* Parallel section
* Compressor
.param rho0=1.21 c0=343
.func X(n) {table(n,1,0.00516500000000003,2,0.00516499999999998,3,0.005165,4,0.00516499999999998,5,0.00516500000000003,6,0.005165,7,0.00516499999999998,8,0.00516500000000003,9,0.00516499999999998,10,0.005165,11,0.005165,12,0.005165,13,0.005165,14,0.005165,15,0.005165,16,0.005165,17,0.00516499999999998,18,0.00516500000000003,19,0.005,20,0.005,21,0.005,22,0.005,23,0.005,24,0.005,25,0.00499999999999995,26,0.005,27,0.005)}
.func S(n) {table(n,1,0.000101569999990205,2,0.00010267999999428,3,0.000104260000015206,4,0.000105360000008812,5,0.000107829999992529,6,0.000114010000011124,7,0.000124240000011441,8,0.000137530000004994,9,0.000152680000012713,10,0.000168780000018052,11,0.000185440000006877,12,0.000202760000016651,13,0.000221379999987761,14,0.000242350000017738,15,0.000266620000003016,16,0.00029481999997399,17,0.000327350000158122,18,0.000363850000046359,19,0.000406440000084485,20,0.000427330000332941,21,0.000496469999910017,22,0.000592849999906204,23,0.000724820000043707,24,0.000911000000046875,25,0.00116684999984727,26,0.00147168000025428,27,0.0017486199997878)}
.func L(n) {rho0/S(n)*X(n)/2}
.func C(n) {S(n)/(rho0*c0*c0)*X(n)}
.param S0=S(1) a0=sqrt(S0/PI) l0=0.16826 n=20
.param L_p={rho0/S0*(l0/n)} C_p={S0/(rho0*c0*c0)*(l0/n)}
.param S28=0.00222514 a28=sqrt(S28/PI)
.param l1=0.028596625123448606 l2=0.0013411719081286178 l3=4.918839592787838E-4
.param c1={1/141936.71972920818} c2={1/931157.5105025952} c3={1/1809777.3579759833}
.param phi1=37.47048679642662 phi2=2.4855617498927827 phi3=1.8325667984395029
.param A=0.0036417751495247705
.param A1={0.49105789017885293*A} A2={4.641306076294213*A} A3={0.008159872921131028*A}
.ac lin 5000 1 5k
.param C_c {1/(2*pi*100*4.518859697974938E7)}
;.param L_c {1/((2*pi*f0)**2*C_c)}
.param L_c {38361.196102405345/(2*pi*100)}
.backanno
.end